# Altium schematic sheet bluetooth.SchDoc: TTN Gateway Bluetooth System
size A4; Author: S. Haitjema; CompanyName: Tweetonig; Address1: Delftsestraat 11; Address2: Rotterdam; DocumentNumber: 3; Revision: 1; SheetNumber: 3; SheetTotal: 9
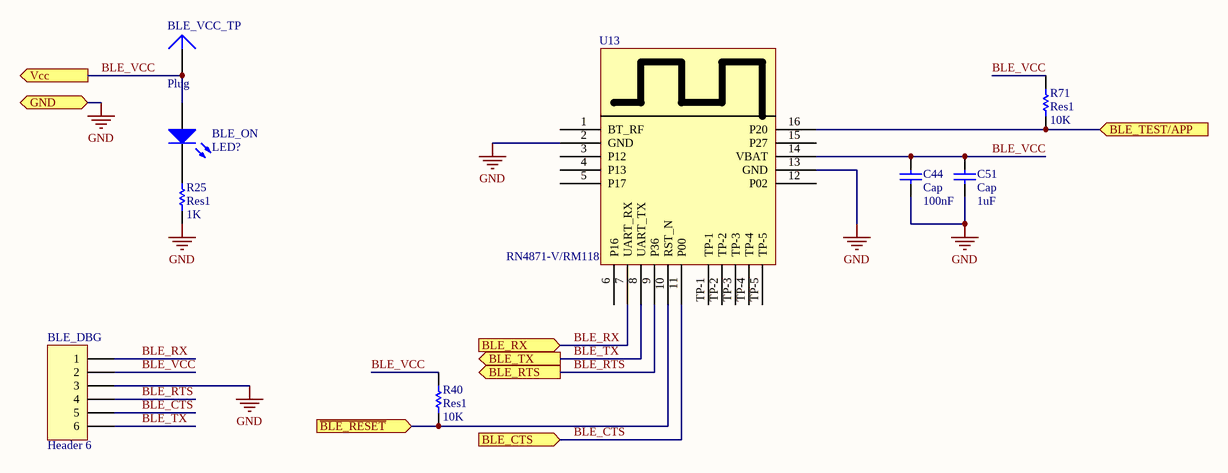
[diagram p0: bluetooth.SchDoc]

## Parts
BLE_DBG  Header 6  [HDR1X6]
BLE_ON  LED?  [C0603]
BLE_VCC_TP  Plug  [PIN1]
C44  Cap  value 100nF  [C0603]
C51  Cap  value 1uF  [C0603]
R25  Res1  value 1K  [R0603]
R40  Res1  value 10K  [R0603]
R71  Res1  value 10K  [R0603]
U13  RN4871-V/RM118  [BM71BLES1FC2]

## Ports
BLE_CTS (in), BLE_RTS (out), BLE_RX (in), BLE_TEST/APP (in), BLE_TX (out), GND (bidir), Vcc (out), ~{BLE_RESET} (in)

## Nets
GND: BLE_DBG.3 C44.1 C51.1 R25.1 U13.2(GND) U13.13(GND) ; port GND
~{BLE_RESET}: R40.1 U13.10(RST_N) ; port ~{BLE_RESET}
BLE_CTS: BLE_DBG.5 U13.11(P00) ; port BLE_CTS
BLE_RTS: BLE_DBG.4 U13.9(P36) ; port BLE_RTS
BLE_RX: BLE_DBG.1 U13.7(UART_RX) ; port BLE_RX
BLE_TEST/APP: R71.1 U13.16(P20) ; port BLE_TEST/APP
BLE_TX: BLE_DBG.6 U13.8(UART_TX) ; port BLE_TX
BLE_VCC: BLE_DBG.2 BLE_ON.1(A) BLE_VCC_TP.1 C44.2 C51.2 R40.2 R71.2 U13.14(VBAT) ; port Vcc
NetBLE_ON_2: BLE_ON.2(K) R25.2

Not connected (* = marked no-connect by the designer): U13 1(BT_RF) 3(P12) 4(P13) 5(P17) 6(P16) 12(P02) 15(P27) TP-1 TP-2 TP-3 TP-4 TP-5

## Notes on the sheet
- Title
- Size:
- Date:
- A4
- Number:
- Time:
- Revision:
- Sheet
- of
- The Things Products
- Project:
- File:

## Library data of the parts
BLE_DBG = Header 6: Header, 6-Pin; LatestRevisionDate: 17-Jul-2002; LatestRevisionNote: Re-released for DXP Platform.; Publisher: Altium Limited
BLE_ON = LED0: Typical INFRARED GaAs LED; Published: 8-Jun-2000; LatestRevisionDate: 08-Jul-2005; LatestRevisionNote: Mech Layer 1 removed.; PackageReference: LED-0; Publisher: Altium Limited; PackageDescription: LED; 2 Leads
C44 C51 = Cap: Capacitor; Published: 8-Jun-2000; LatestRevisionDate: 17-Jul-2002; LatestRevisionNote: Re-released for DXP Platform.; PackageReference: RAD-0.3; Publisher: Altium Limited; PackageDescription: Radial Cap, Thru-Hole; 2 Leads; 0.3 in Pin Spacing
R25 R40 R71 = Res1: Resistor; Published: 8-Jun-2000; LatestRevisionDate: 17-Jul-2002; LatestRevisionNote: Re-released for DXP Platform.; PackageReference: AXIAL-0.3; Publisher: Altium Limited; PackageDescription: Axial Device, Thru-Hole; 2 Leads; 0.3 in Pin Spacing
U13 = BM718LES1FC2: RN4871-V/RM118 Bluetooth 4.2 LE Mesh
BLE_VCC_TP = Plug: LatestRevisionDate: 17-Jul-2002; LatestRevisionNote: Re-released for DXP Platform.; Publisher: Altium Limited